# Altium schematic sheet PWR_BUCK.SchDoc
size A4
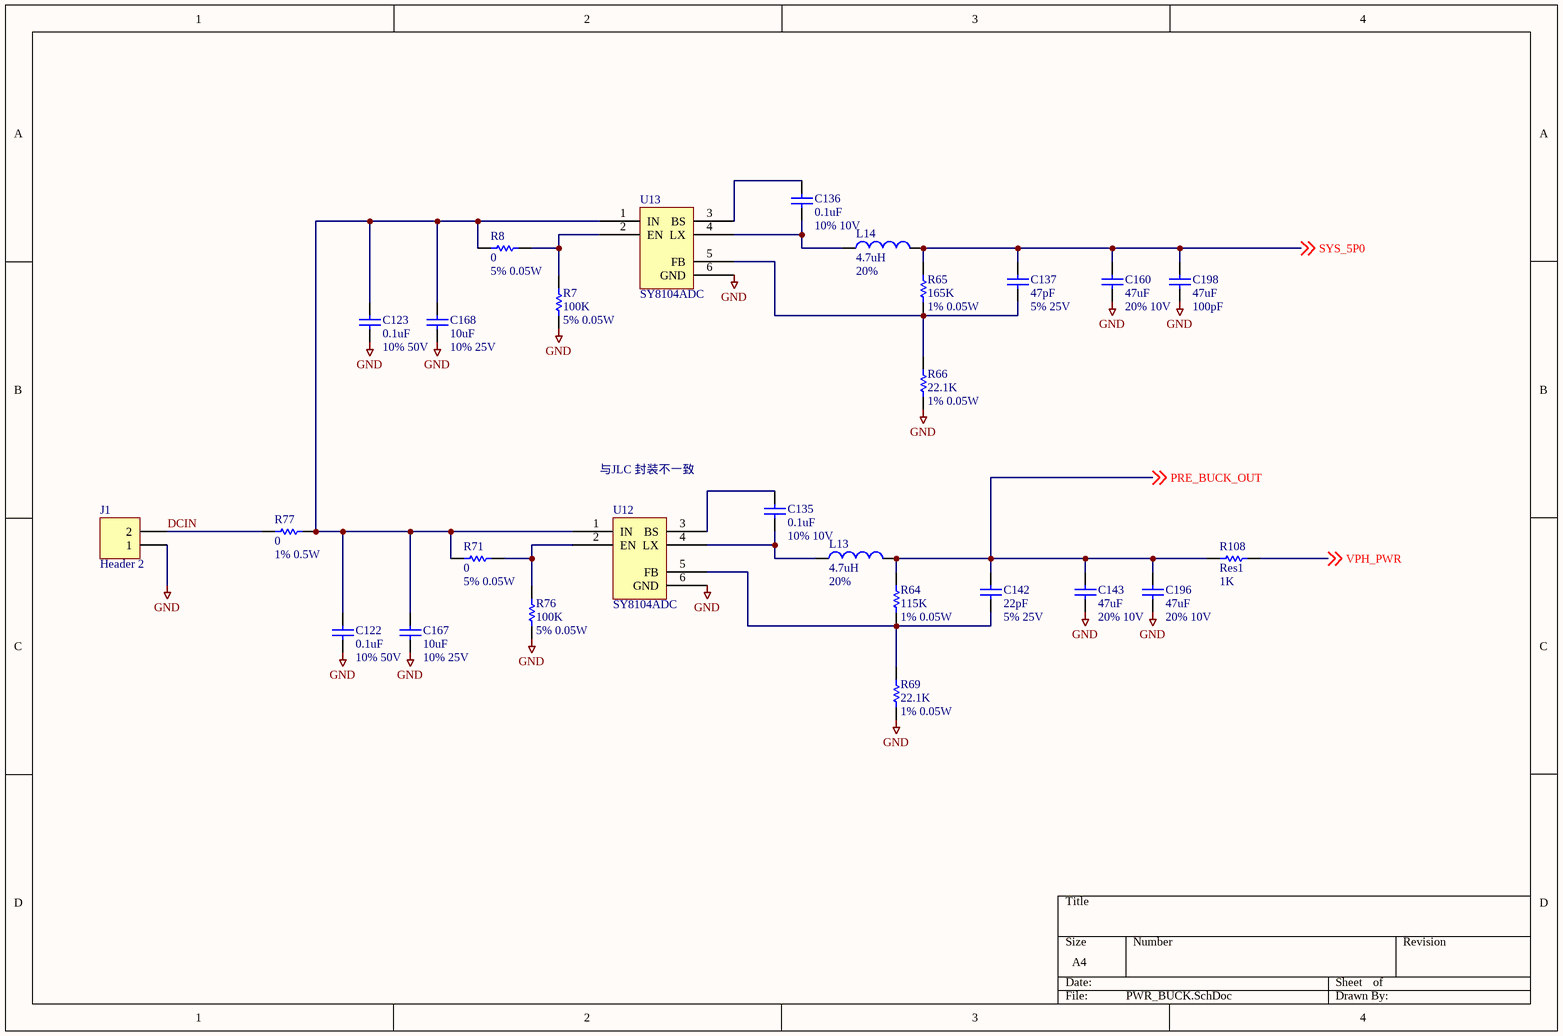
[diagram p0: PWR_BUCK.SchDoc]

## Parts
C122  0.1uF  value 10% 50V  [RAD-0.3]
C123  0.1uF  value 10% 50V  [RAD-0.3]
C135  0.1uF  value 10% 10V  [RAD-0.3]
C136  0.1uF  value 10% 10V  [RAD-0.3]
C137  47pF  value 5% 25V  [RAD-0.3]
C142  22pF  value 5% 25V  [RAD-0.3]
C143  47uF  value 20% 10V  [RAD-0.3]
C160  47uF  value 20% 10V  [RAD-0.3]
C167  10uF  value 10% 25V  [RAD-0.3]
C168  10uF  value 10% 25V  [RAD-0.3]
C196  47uF  value 20% 10V  [RAD-0.3]
C198  47uF  value 100pF  [RAD-0.3]
J1  Header 2  [HDR1X2]
L13  4.7uH  value 20%  [0402-A]
L14  4.7uH  value 20%  [0402-A]
R7  100K  value 5% 0.05W  [AXIAL-0.3]
R8  0  value 5% 0.05W  [AXIAL-0.3]
R64  115K  value 1% 0.05W  [AXIAL-0.3]
R65  165K  value 1% 0.05W  [AXIAL-0.3]
R66  22.1K  value 1% 0.05W  [AXIAL-0.3]
R69  22.1K  value 1% 0.05W  [AXIAL-0.3]
R71  0  value 5% 0.05W  [AXIAL-0.3]
R76  100K  value 5% 0.05W  [AXIAL-0.3]
R77  0  value 1% 0.5W  [AXIAL-0.3]
R108  Res1  value 1K  [AXIAL-0.3]
U12  SY8104ADC
U13  SY8104ADC

## Nets
GND: C122.1 C123.1 C143.1 C160.1 C167.1 C168.1 C196.1 C198.1 J1.1 R7.1 R66.1 R69.1 R76.1 U12.6(GND) U13.6(GND)
DCIN: J1.2 R77.1
PRE_BUCK_OUT: C142.2 C143.2 C196.2 L13.2 R64.2 R108.1 ; off-sheet PRE_BUCK_OUT
SYS_5P0: C137.2 C160.2 C198.2 L14.2 R65.2 ; off-sheet SYS_5P0
VPH_PWR: R108.2 ; off-sheet VPH_PWR
NetC122_2: C122.2 C123.2 C167.2 C168.2 R8.1 R71.1 R77.2 U12.1(IN) U13.1(IN)
NetC135_1: C135.1 L13.1 U12.4(LX)
NetC135_2: C135.2 U12.3(BS)
NetC136_1: C136.1 L14.1 U13.4(LX)
NetC136_2: C136.2 U13.3(BS)
NetC137_1: C137.1 R65.1 R66.2 U13.5(FB)
NetC142_1: C142.1 R64.1 R69.2 U12.5(FB)
NetR7_2: R7.2 R8.2 U13.2(EN)
NetR71_2: R71.2 R76.2 U12.2(EN)

## Notes on the sheet
- 与JLC 封装不一致

## Library data of the parts
C122 C123 C135-C137 C142 C143 C160 C167 C168 C196 C198 = Cap: Capacitor; Published: 8-Jun-2000; LatestRevisionDate: 17-Jul-2002; LatestRevisionNote: Re-released for DXP Platform.; PackageReference: RAD-0.3; Publisher: Altium Limited; PackageDescription: Radial Cap, Thru-Hole; 2 Leads; 0.3 in Pin Spacing
J1 = Header 2: Header, 2-Pin; LatestRevisionDate: 17-Jul-2002; LatestRevisionNote: Re-released for DXP Platform.; Publisher: Altium Limited
L13 L14 = Inductor: Code_IEC: 1005; Published: 8-Jun-2000; LatestRevisionDate: 29-May-2009; LatestRevisionNote: IPC-7351 Footprint Added.; PackageReference: 0402-A; Publisher: Altium Limited; PackageDescription: Chip Inductor; Code_JEITA: 0402
R7 R8 R64-R66 R69 R71 R76 R77 R108 = Res1: Resistor; Published: 8-Jun-2000; LatestRevisionDate: 17-Jul-2002; LatestRevisionNote: Re-released for DXP Platform.; PackageReference: AXIAL-0.3; Publisher: Altium Limited; PackageDescription: Axial Device, Thru-Hole; 2 Leads; 0.3 in Pin Spacing